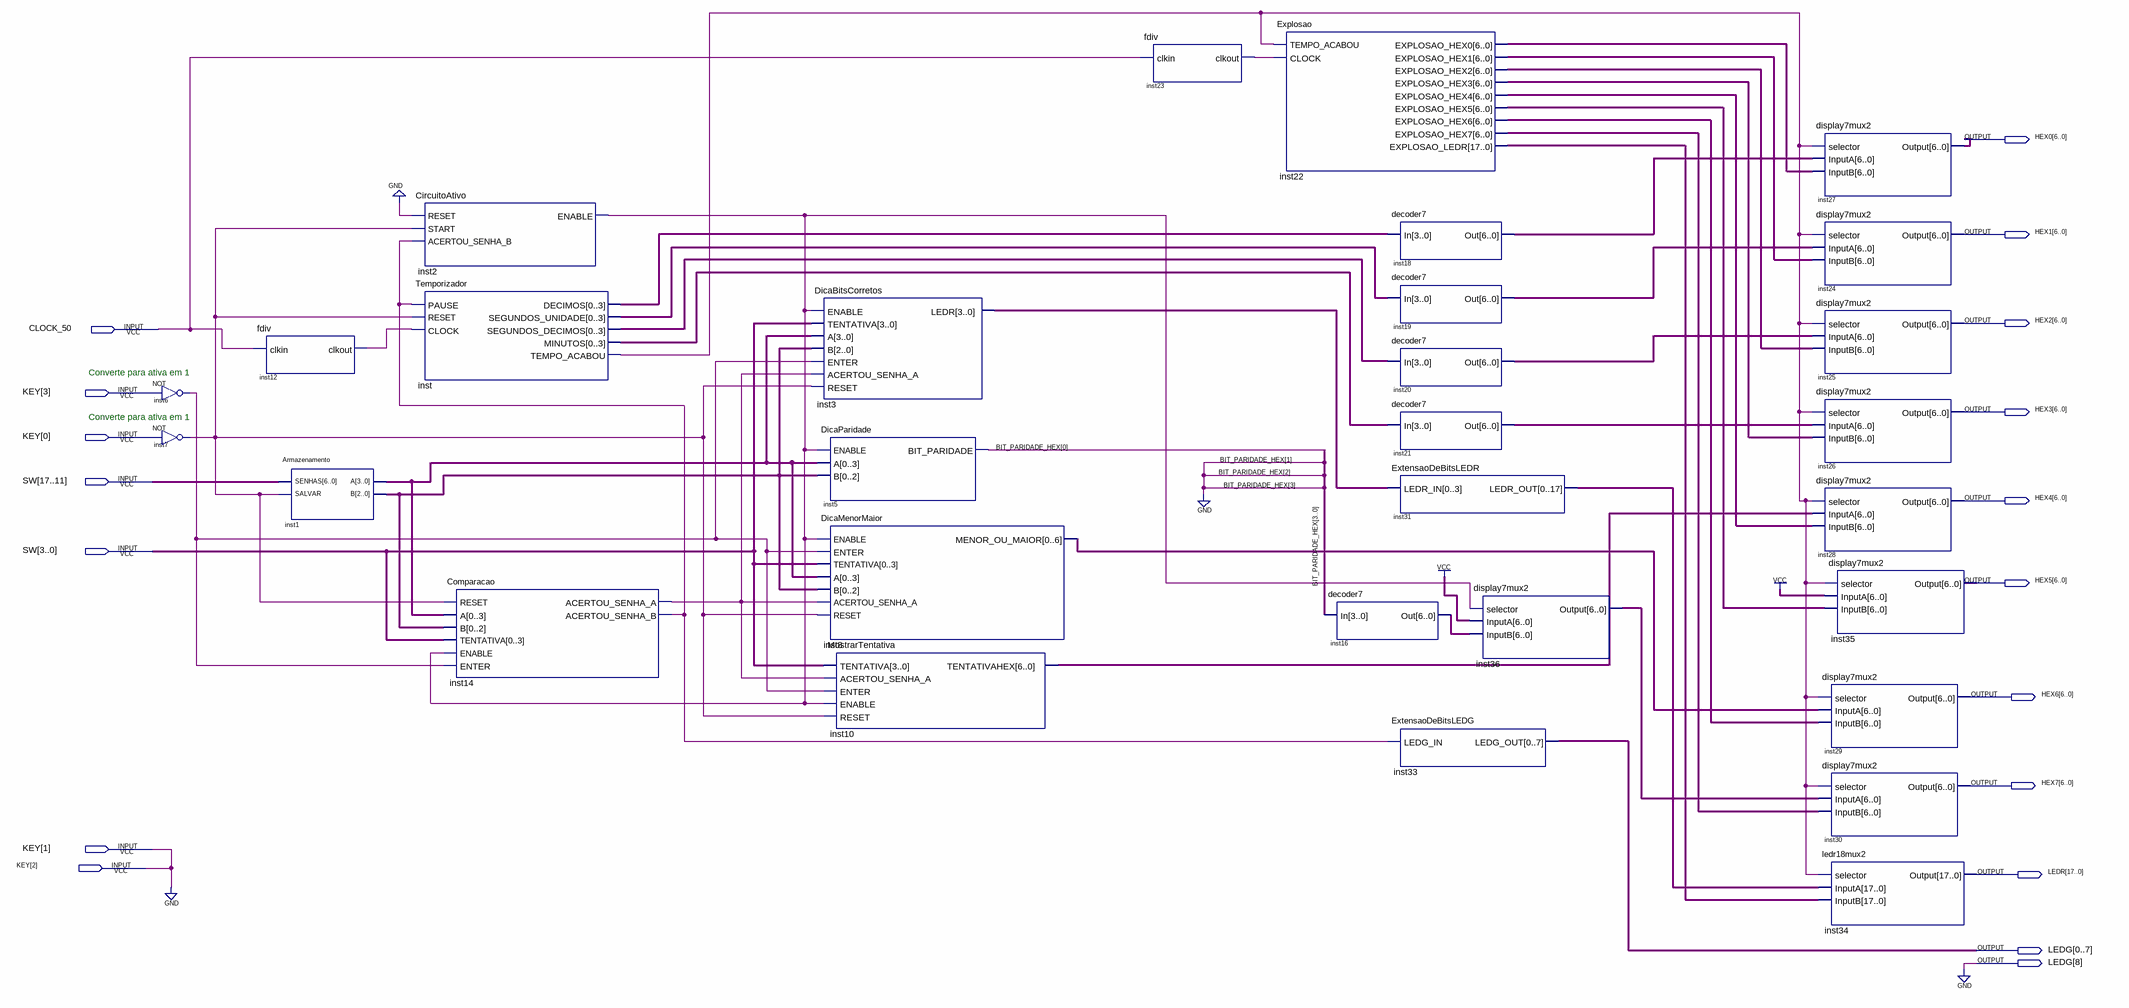
[diagram p0: schematic sheet]
// Quartus schematic ProjetoFinal.bdf as structural Verilog: 30 symbols, 18 pins
module ProjetoFinal (
  input  CLOCK_50,
  input  [3:0] KEY,
  input  [17:0] SW,
  output [6:0] HEX0,
  output [6:0] HEX1,
  output [6:0] HEX2,
  output [6:0] HEX3,
  output [6:0] HEX4,
  output [6:0] HEX5,
  output [6:0] HEX6,
  output [6:0] HEX7,
  output [17:0] LEDR,
  output [0:8] LEDG
);

  wire inst2_enable, inst6_out, inst7_out, inst12_clkout, inst14_acertou_senha_a, inst14_acertou_senha_b,
       inst23_clkout, inst_tempo_acabou;
  wire [0:0] BIT_PARIDADE_HEX;
  wire [2:0] inst1_b;
  wire [3:0] inst1_a, inst3_ledr, inst_decimos, inst_minutos, inst_segundos_decimos, inst_segundos_unidade;
  wire [6:0] inst8_menor_ou_maior, inst10_tentativahex, inst16_out, inst18_out, inst19_out, inst20_out,
       inst21_out, inst22_explosao_hex0, inst22_explosao_hex1, inst22_explosao_hex2, inst22_explosao_hex3,
       inst22_explosao_hex4, inst22_explosao_hex5, inst22_explosao_hex6, inst22_explosao_hex7, inst36_output;
  wire [17:0] inst22_explosao_ledr, inst31_ledr_out;

  not inst6 (inst6_out, KEY[3]);
  not inst7 (inst7_out, KEY[0]);
  fdiv inst12 (.clkin(CLOCK_50), .clkout(inst12_clkout));
  Armazenamento inst1 (.SENHAS(SW[17:11]), .SALVAR(inst7_out), .A(inst1_a), .B(inst1_b));
  CircuitoAtivo inst2 (
    .RESET(1'b0), .START(inst7_out), .ACERTOU_SENHA_B(inst14_acertou_senha_b), .ENABLE(inst2_enable));
  Temporizador inst (
    .PAUSE(inst14_acertou_senha_b), .RESET(inst7_out), .CLOCK(inst12_clkout), .DECIMOS(inst_decimos),
    .SEGUNDOS_UNIDADE(inst_segundos_unidade), .SEGUNDOS_DECIMOS(inst_segundos_decimos),
    .MINUTOS(inst_minutos), .TEMPO_ACABOU(inst_tempo_acabou));
  Comparacao inst14 (
    .RESET(inst7_out), .A(inst1_a), .B(inst1_b), .TENTATIVA(SW[3:0]), .ENABLE(inst2_enable),
    .ENTER(inst6_out), .ACERTOU_SENHA_A(inst14_acertou_senha_a), .ACERTOU_SENHA_B(inst14_acertou_senha_b));
  DicaBitsCorretos inst3 (
    .ENABLE(inst2_enable), .TENTATIVA(SW[3:0]), .A(inst1_a), .B(inst1_b), .ENTER(inst6_out),
    .ACERTOU_SENHA_A(inst14_acertou_senha_a), .RESET(inst7_out), .LEDR(inst3_ledr));
  DicaParidade inst5 (.ENABLE(inst2_enable), .A(inst1_a), .B(inst1_b), .BIT_PARIDADE(BIT_PARIDADE_HEX[0]));
  DicaMenorMaior inst8 (
    .ENABLE(inst2_enable), .ENTER(inst6_out), .TENTATIVA(SW[3:0]), .A(inst1_a), .B(inst1_b),
    .ACERTOU_SENHA_A(inst14_acertou_senha_a), .RESET(inst7_out), .MENOR_OU_MAIOR(inst8_menor_ou_maior));
  MostrarTentativa inst10 (
    .TENTATIVA(SW[3:0]), .ACERTOU_SENHA_A(inst14_acertou_senha_a), .ENTER(inst6_out), .ENABLE(inst2_enable),
    .RESET(inst7_out), .TENTATIVAHEX(inst10_tentativahex));
  fdiv inst23 (.clkin(CLOCK_50), .clkout(inst23_clkout));
  Explosao inst22 (
    .TEMPO_ACABOU(inst_tempo_acabou), .CLOCK(inst23_clkout), .EXPLOSAO_HEX0(inst22_explosao_hex0),
    .EXPLOSAO_HEX1(inst22_explosao_hex1), .EXPLOSAO_HEX2(inst22_explosao_hex2),
    .EXPLOSAO_HEX3(inst22_explosao_hex3), .EXPLOSAO_HEX4(inst22_explosao_hex4),
    .EXPLOSAO_HEX5(inst22_explosao_hex5), .EXPLOSAO_HEX6(inst22_explosao_hex6),
    .EXPLOSAO_HEX7(inst22_explosao_hex7), .EXPLOSAO_LEDR(inst22_explosao_ledr));
  decoder7 inst16 (.In({3'b000, BIT_PARIDADE_HEX[0]}), .Out(inst16_out));
  decoder7 inst18 (.In(inst_decimos), .Out(inst18_out));
  decoder7 inst19 (.In(inst_segundos_unidade), .Out(inst19_out));
  decoder7 inst20 (.In(inst_segundos_decimos), .Out(inst20_out));
  decoder7 inst21 (.In(inst_minutos), .Out(inst21_out));
  ExtensaoDeBitsLEDR inst31 (.LEDR_IN(inst3_ledr), .LEDR_OUT(inst31_ledr_out));
  ExtensaoDeBitsLEDG inst33 (.LEDG_IN(inst14_acertou_senha_b), .LEDG_OUT(LEDG[0:7]));
  display7mux2 inst36 (.selector(inst2_enable), .InputA({7{1'b1}}), .InputB(inst16_out), .Output(inst36_output));
  display7mux2 inst27 (.selector(inst_tempo_acabou), .InputA(inst18_out), .InputB(inst22_explosao_hex0), .Output(HEX0));
  display7mux2 inst24 (.selector(inst_tempo_acabou), .InputA(inst19_out), .InputB(inst22_explosao_hex1), .Output(HEX1));
  display7mux2 inst25 (.selector(inst_tempo_acabou), .InputA(inst20_out), .InputB(inst22_explosao_hex2), .Output(HEX2));
  display7mux2 inst26 (.selector(inst_tempo_acabou), .InputA(inst21_out), .InputB(inst22_explosao_hex3), .Output(HEX3));
  display7mux2 inst28 (
    .selector(inst_tempo_acabou), .InputA(inst10_tentativahex), .InputB(inst22_explosao_hex4), .Output(HEX4));
  display7mux2 inst35 (.selector(inst_tempo_acabou), .InputA({7{1'b1}}), .InputB(inst22_explosao_hex5), .Output(HEX5));
  display7mux2 inst29 (
    .selector(inst_tempo_acabou), .InputA(inst8_menor_ou_maior), .InputB(inst22_explosao_hex6), .Output(HEX6));
  display7mux2 inst30 (
    .selector(inst_tempo_acabou), .InputA(inst36_output), .InputB(inst22_explosao_hex7), .Output(HEX7));
  ledr18mux2 inst34 (
    .selector(inst_tempo_acabou), .InputA(inst31_ledr_out), .InputB(inst22_explosao_ledr), .Output(LEDR));

  assign KEY[1] = KEY[2];
  assign LEDG[8] = 1'b0;
  // also tied to GND on the sheet: KEY[2]

  // Notes on the sheet:
  //   Converte para ativa em 1
  //   Converte para ativa em 1
endmodule
